# EAGLE design Modular-LED-Lamp (EAGLE 7.7.0)
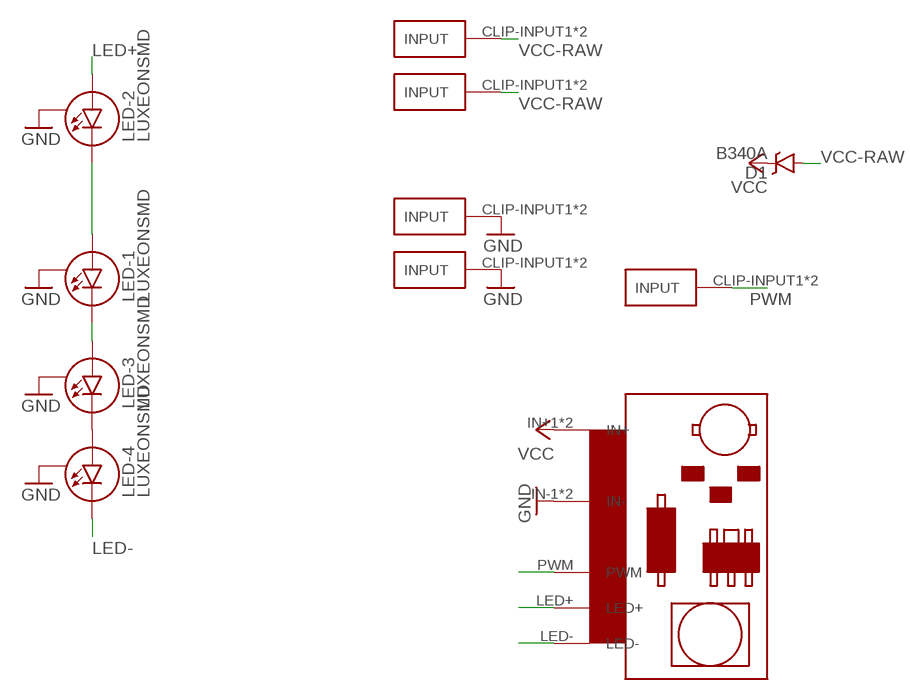
[diagram p0: schematic, sheet 1]

## Parts
D1  B340A  DIODE-SCHOTTKY-B340A  [SMA-DIODE]
GND-CLIP  GND  FUSE-HOLDER-5X20MM  [FUSE-HOLDER-5X20MM]
GND-CLIP2  GND  FUSE-HOLDER-5X20MM  [FUSE-HOLDER-5X20MM]
LED-1  LUXEONSMD  [LUXEON]
LED-2  LUXEONSMD  [LUXEON]
LED-3  LUXEONSMD  [LUXEON]
LED-4  LUXEONSMD  [LUXEON]
PWM-CLIP  FUSE-HOLDER-5X20MM  [FUSE-HOLDER-5X20MM]
U$1  PT4115-MODULE  [PT4115-MODULE]
VCC-CLIP  FUSE-HOLDER-5X20MM  [FUSE-HOLDER-5X20MM]
VCC-CLIP2  FUSE-HOLDER-5X20MM  [FUSE-HOLDER-5X20MM]

## Nets
GND: GND-CLIP2.CLIP-INPUT1(INPUT) GND-CLIP2.CLIP-INPUT2(INPUT) GND-CLIP.CLIP-INPUT1(INPUT) GND-CLIP.CLIP-INPUT2(INPUT) LED-1.S LED-2.S LED-3.S LED-4.S U$1.IN-1(IN-) U$1.IN-2(IN-)
LED+: LED-2.A U$1.LED+
LED-: LED-4.C U$1.LED-
N$1: LED-1.C LED-3.A
N$2: LED-3.C LED-4.A
N$3: LED-1.A LED-2.C
PWM: PWM-CLIP.CLIP-INPUT1(INPUT) PWM-CLIP.CLIP-INPUT2(INPUT) U$1.PWM
VCC: D1.C U$1.IN+1(IN+) U$1.IN+2(IN+)
VCC-RAW: D1.A VCC-CLIP2.CLIP-INPUT1(INPUT) VCC-CLIP2.CLIP-INPUT2(INPUT) VCC-CLIP.CLIP-INPUT1(INPUT) VCC-CLIP.CLIP-INPUT2(INPUT)

## Library data of the parts
D1 = SparkFun-DiscreteSemi:DIODE-SCHOTTKY: Schottky diodes in SFE's production catalog BAT20J 1A 23V 0.62Vf RB751 120mA 40V 0.37Vf PMEG4005EJ 0.5A 40V 0.42Vf MBRA140 1A 40V 0.5Vf B340A 3A 40V SMA; PROD_ID: DIO-09886
GND-CLIP GND-CLIP2 PWM-CLIP VCC-CLIP VCC-CLIP2 = timon-diverses:FUSE-HOLDER-5X20MM
LED-1-LED-4 = SparkFun-LED:LUXEON: Luxeon LED This footprint works with the current 1 Watt, 3 Watt, and 5 Watt LEDs. These blindingly bright LEDs generate a lot of heat so the footprint has a large pad under the LED for thermal transfer. Schematic and footprint are proven. Spark Fun Electronics SKU : COM-00603
U$1 = timon-diverses:PT4115-MODULE

## Board
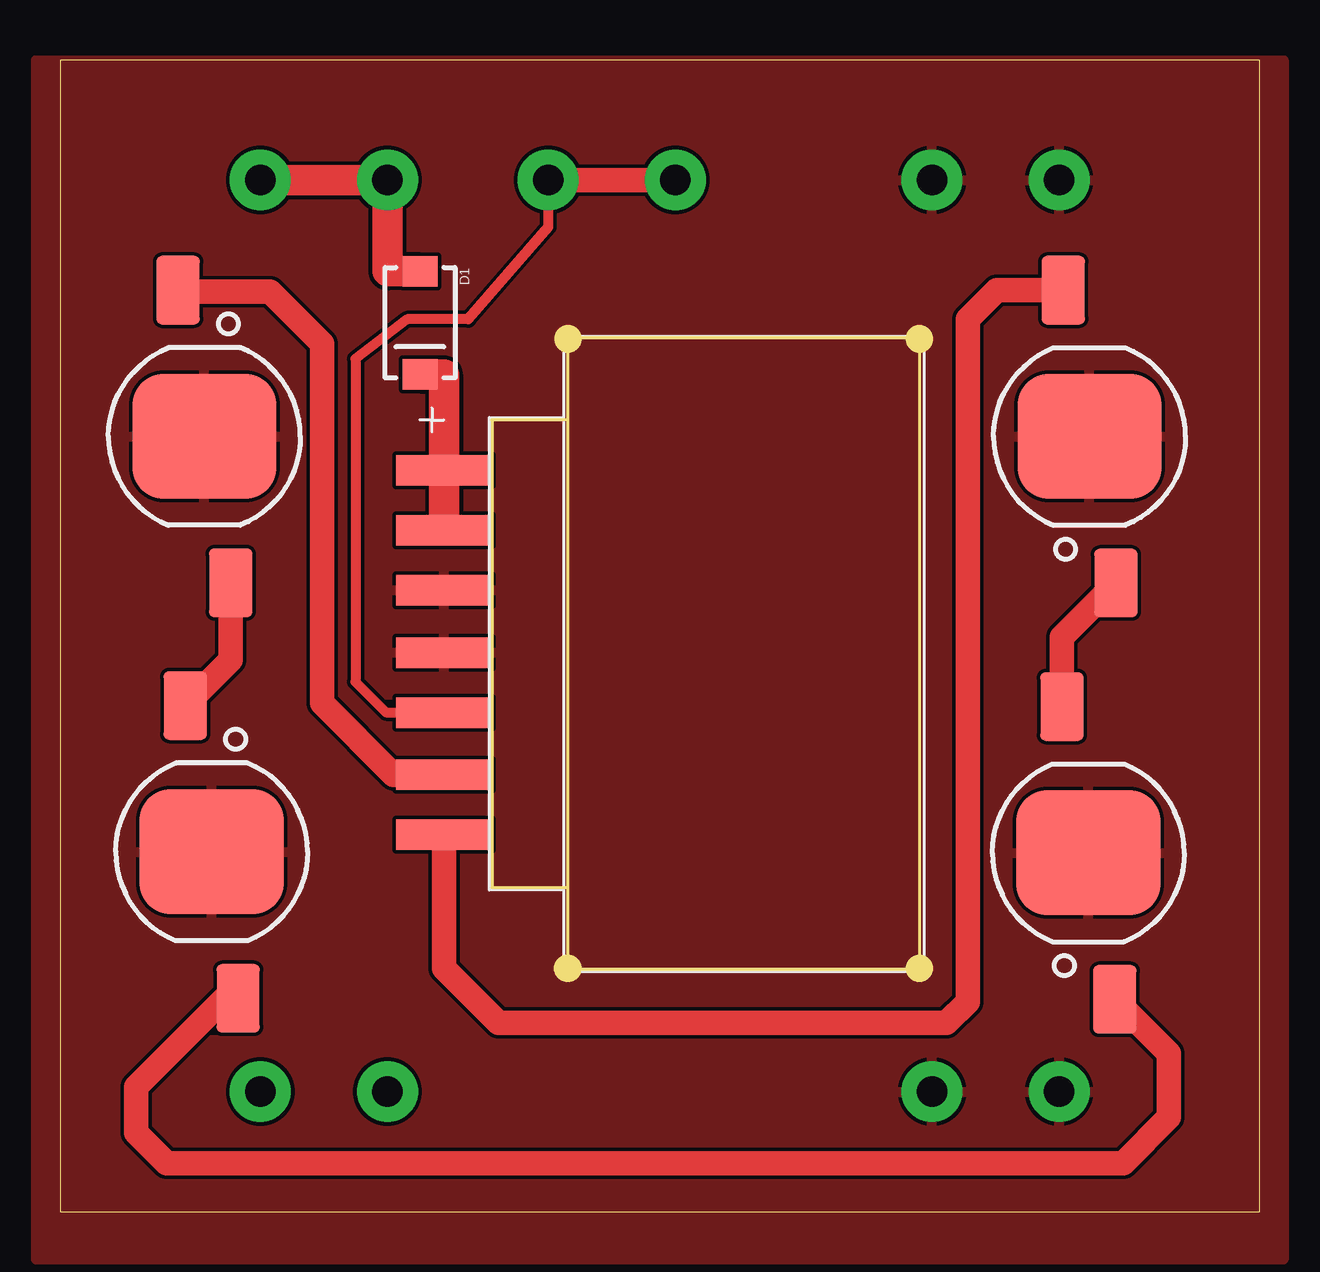
[diagram p1: board, top side]
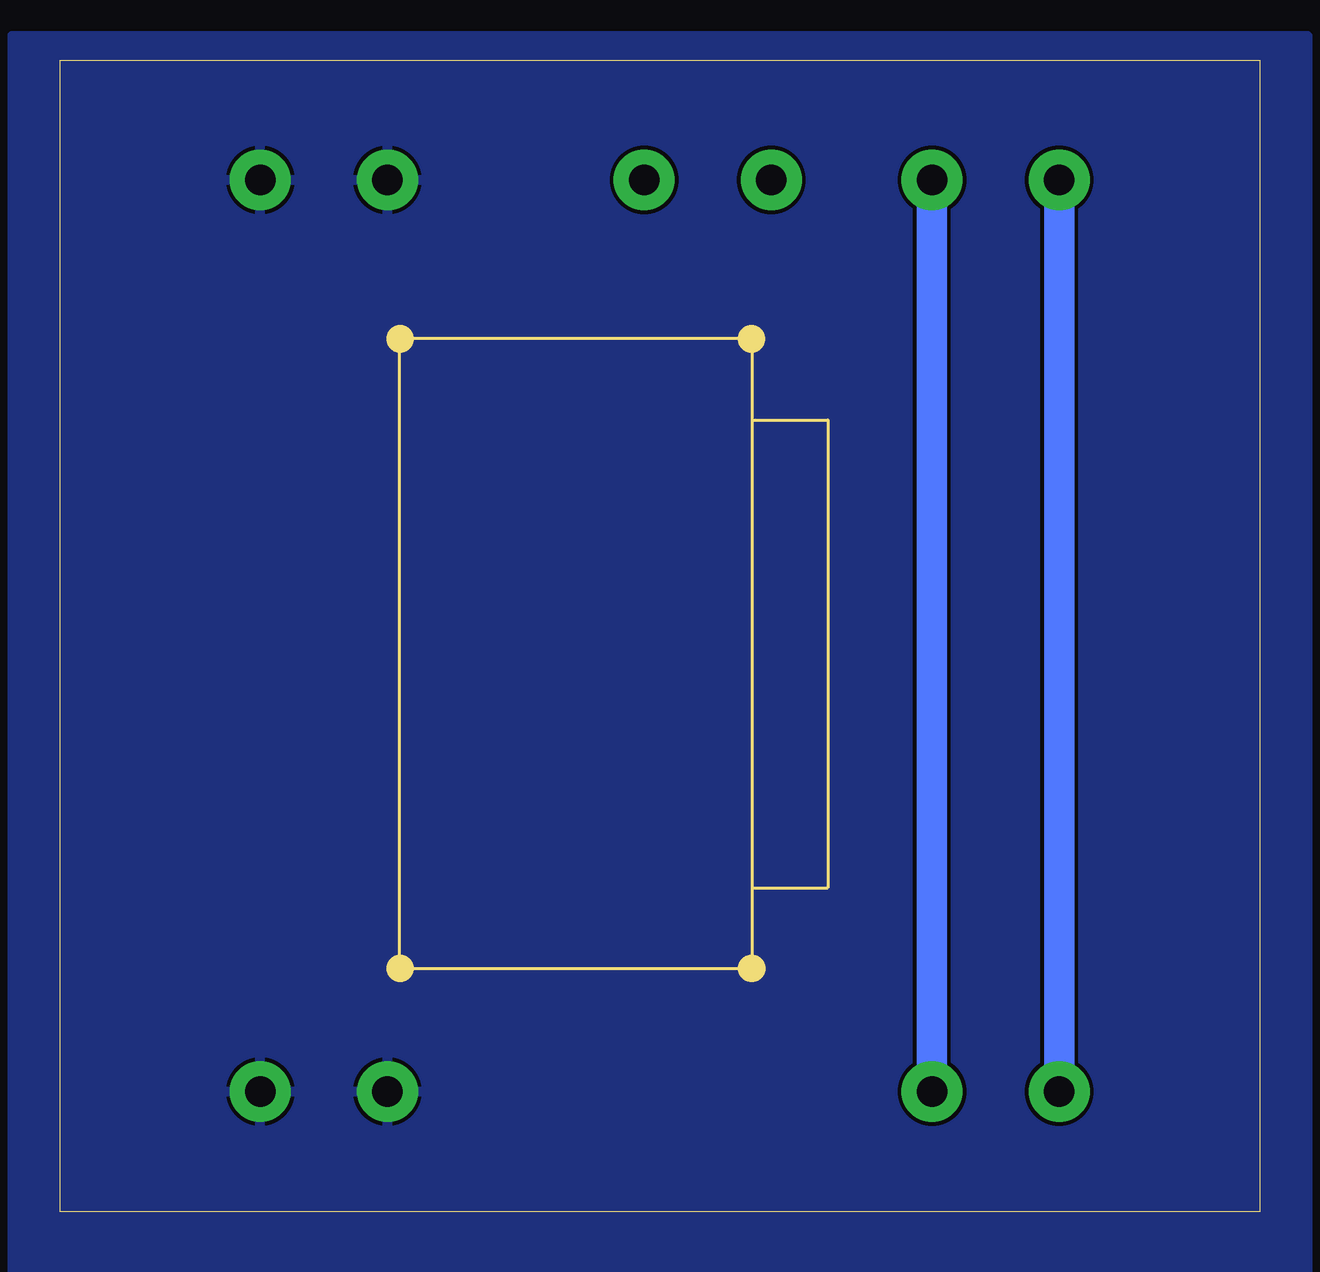
[diagram p2: board, bottom side, seen from below]

Size 50 x 48 mm. Coordinates in mm from the lower left corner, seen from the top.
Outline: 0,0 50,0 50,48 0,48 0,0
Copper layers (1*16): Top 0.035mm / dielectric 1.5mm / Bottom 0.035mm
Design rules "OthermillDRC_30_deg_v2": minimum track width 6mil, minimum drill 0.8mm, track to track 6mil, track to pad 6mil, pad to pad 6mil, via to via 6mil, smd to smd 0mil, copper to edge 0mil, drill to drill 6mil, minimum pad ring 10mil, minimum via ring 10mil, stop-mask expansion 1mil, vias tented up to drill 30mil, thermal gap 6mil

### Footprints (pad centres in the part's own frame; a part is rotated, then mirrored left to right if it is on the bottom)
SMA-DIODE = smd 1.27 x 1.47: A -2.15,0; C 2.15,0
FUSE-HOLDER-5X20MM = drill 1.27 pad 2.54: CLIP-INPUT1 -2.65,0; CLIP-INPUT2 2.65,0
LUXEON = smd 2.85 x 1.8: A -6.1,-1.1; C 6.1,1.1 | smd 5.2 x 6: S 0,0
PT4115-MODULE = smd 1.27 x 4: IN+1 7.9,13; IN+2 5.4,13; IN-1 2.9,13; IN-2 0.3,13; LED+ -4.8,13; LED- -7.3,13; PWM -2.2,13

### Placement (x,y rotation side)
D1  15.01,37.04 270 top
GND-CLIP  39,43 0 top
GND-CLIP2  39,5 0 top
LED-1  6.33,14.99 270 top
LED-2  6.02,32.31 270 top
LED-3  42.86,14.95 90 top
LED-4  42.91,32.3 90 top
PWM-CLIP  23,43 0 top
U$1  29,23 90 top
VCC-CLIP  11,43 0 top
VCC-CLIP2  11,5 0 top

### Tracks (layer width: path | path; a pad name or v marks a point on that pad's centre or on a via)
GND
  pour Top: -1,48 51,48 51,-2 -1,-2
  pour Bottom: -2,49 52,49 52,-3 -2,-3
LED+
  Top 1.016: U$1.LED+ 13.91,18.2 10.92,21.19 10.92,36.18 8.76,38.34 4.99,38.34 LED-2.A
LED-
  Top 1.016: LED-4.C 39.06,38.41 37.85,37.2 37.85,8.75 36.96,7.86 18.29,7.86 16,10.14 U$1.LED-
N$1
  Top 1.016: LED-1.C 6.88,8.89 3.17,5.19 3.17,3.29 4.45,2.02 44.32,2.02 46.23,3.92 46.23,6.58 LED-3.A
N$2
  Top 1.016: LED-3.C 41.76,23.95 LED-4.A
N$3
  Top 1.016: LED-2.C 7.12,22.99 LED-1.A
PWM
  Top 0.406: U$1.PWM 15.99,20.81 13.59,20.81 12.32,22.08 12.32,35.54 14.48,37.2 17.02,37.2 20.35,41.03 PWM-CLIP.CLIP-INPUT1
  Top 1.016: PWM-CLIP.CLIP-INPUT2 PWM-CLIP.CLIP-INPUT1
VCC
  Top 1.27: U$1.IN+2 U$1.IN+1 16,34.89 D1.C
VCC-RAW
  Top 1.27: D1.A 13.65,39.19 VCC-CLIP.CLIP-INPUT2 VCC-CLIP.CLIP-INPUT1
  Bottom 1.27: VCC-CLIP2.CLIP-INPUT2 VCC-CLIP.CLIP-INPUT2 | VCC-CLIP2.CLIP-INPUT1 VCC-CLIP.CLIP-INPUT1